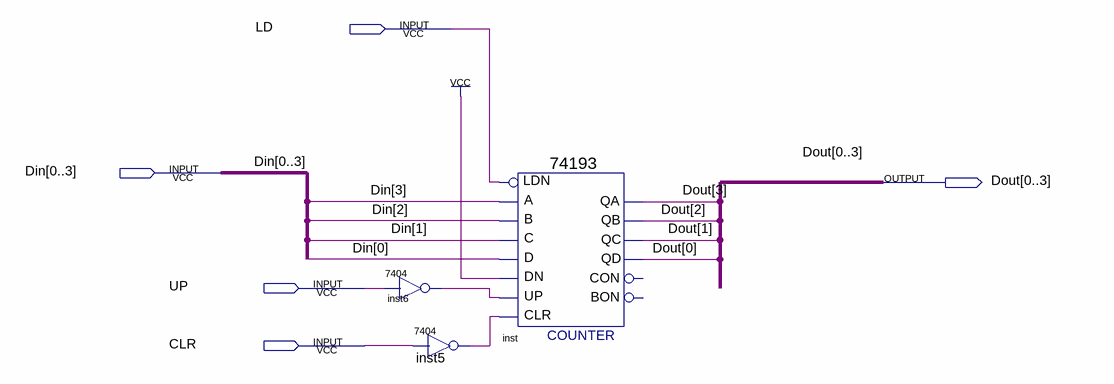
[diagram p0: schematic sheet]
// Quartus schematic ProgramCounter.bdf as structural Verilog: 3 symbols, 5 pins
module ProgramCounter (
  input  LD,
  input  [0:3] Din,
  input  UP,
  input  CLR,
  output [0:3] Dout
);

  wire inst5_1, inst6_1;

  \7404  inst6 (.\2 (UP), .\1 (inst6_1));
  \7404  inst5 (.\2 (CLR), .\1 (inst5_1));
  \74193  inst (
    .D(Din[0]), .C(Din[1]), .B(Din[2]), .A(Din[3]), .CLR(inst5_1), .UP(inst6_1), .DN(1'b1), .LDN(LD),
    .QB(Dout[2]), .QA(Dout[3]), .QD(Dout[0]), .QC(Dout[1]));  // open: CON, BON
endmodule
